# Altium schematic sheet HPC_GH.SchDoc: HPC connector ROW G and ROW H
size A4; Date: 20.05.2022; ApprovedBy: PFH; CompanyName: IAM Electronic GmbH; DrawnBy: PFH; Engineer: PFH; Revision: A; SheetNumber: 5; SheetTotal: 6; Projekt: FMC Power Module; Website: www.iamelectronic.com
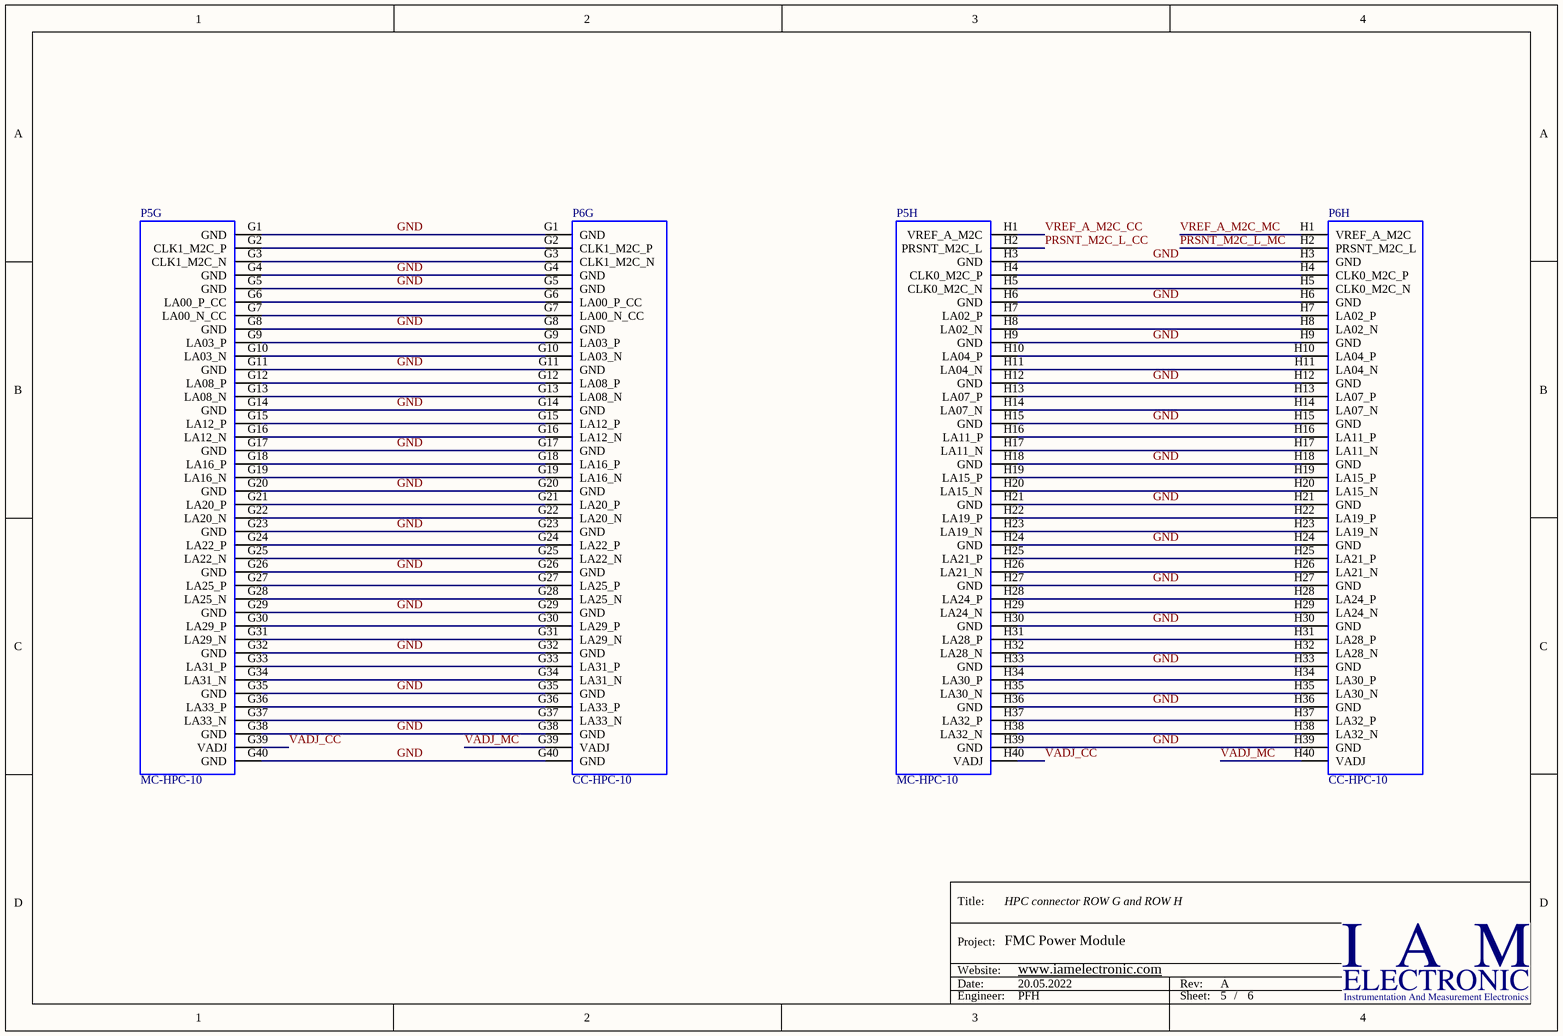
[diagram p0: HPC_GH.SchDoc]

## Parts
P5  MC-HPC-10  [ASP-134488-01]  (parts G,H of 10)
P6  CC-HPC-10  [ASP-134486-01]  (parts G,H of 10)

## Nets
GND: P5.G1(GND) P5.G4(GND) P5.G5(GND) P5.G8(GND) P5.G11(GND) P5.G14(GND) P5.G17(GND) P5.G20(GND) P5.G23(GND) P5.G26(GND) P5.G29(GND) P5.G32(GND) P5.G35(GND) P5.G38(GND) P5.G40(GND) P5.H3(GND) P5.H6(GND) P5.H9(GND) P5.H12(GND) P5.H15(GND) P5.H18(GND) P5.H21(GND) P5.H24(GND) P5.H27(GND) P5.H30(GND) P5.H33(GND) P5.H36(GND) P5.H39(GND) P6.G1(GND) P6.G4(GND) P6.G5(GND) P6.G8(GND) P6.G11(GND) P6.G14(GND) P6.G17(GND) P6.G20(GND) P6.G23(GND) P6.G26(GND) P6.G29(GND) P6.G32(GND) P6.G35(GND) P6.G38(GND) P6.G40(GND) P6.H3(GND) P6.H6(GND) P6.H9(GND) P6.H12(GND) P6.H15(GND) P6.H18(GND) P6.H21(GND) P6.H24(GND) P6.H27(GND) P6.H30(GND) P6.H33(GND) P6.H36(GND) P6.H39(GND)
PRSNT_M2C_L_CC: P5.H2(PRSNT_M2C_L)
PRSNT_M2C_L_MC: P6.H2(PRSNT_M2C_L)
VADJ_CC: P5.G39(VADJ) P5.H40(VADJ)
VADJ_MC: P6.G39(VADJ) P6.H40(VADJ)
VREF_A_M2C_CC: P5.H1(VREF_A_M2C)
VREF_A_M2C_MC: P6.H1(VREF_A_M2C)
NetP5_G2: P5.G2(CLK1_M2C_P) P6.G2(CLK1_M2C_P)
NetP5_G3: P5.G3(CLK1_M2C_N) P6.G3(CLK1_M2C_N)
NetP5_G6: P5.G6(LA00_P_CC) P6.G6(LA00_P_CC)
NetP5_G7: P5.G7(LA00_N_CC) P6.G7(LA00_N_CC)
NetP5_G9: P5.G9(LA03_P) P6.G9(LA03_P)
NetP5_G10: P5.G10(LA03_N) P6.G10(LA03_N)
NetP5_G12: P5.G12(LA08_P) P6.G12(LA08_P)
NetP5_G13: P5.G13(LA08_N) P6.G13(LA08_N)
NetP5_G15: P5.G15(LA12_P) P6.G15(LA12_P)
NetP5_G16: P5.G16(LA12_N) P6.G16(LA12_N)
NetP5_G18: P5.G18(LA16_P) P6.G18(LA16_P)
NetP5_G19: P5.G19(LA16_N) P6.G19(LA16_N)
NetP5_G21: P5.G21(LA20_P) P6.G21(LA20_P)
NetP5_G22: P5.G22(LA20_N) P6.G22(LA20_N)
NetP5_G24: P5.G24(LA22_P) P6.G24(LA22_P)
NetP5_G25: P5.G25(LA22_N) P6.G25(LA22_N)
NetP5_G27: P5.G27(LA25_P) P6.G27(LA25_P)
NetP5_G28: P5.G28(LA25_N) P6.G28(LA25_N)
NetP5_G30: P5.G30(LA29_P) P6.G30(LA29_P)
NetP5_G31: P5.G31(LA29_N) P6.G31(LA29_N)
NetP5_G33: P5.G33(LA31_P) P6.G33(LA31_P)
NetP5_G34: P5.G34(LA31_N) P6.G34(LA31_N)
NetP5_G36: P5.G36(LA33_P) P6.G36(LA33_P)
NetP5_G37: P5.G37(LA33_N) P6.G37(LA33_N)
NetP5_H4: P5.H4(CLK0_M2C_P) P6.H4(CLK0_M2C_P)
NetP5_H5: P5.H5(CLK0_M2C_N) P6.H5(CLK0_M2C_N)
NetP5_H7: P5.H7(LA02_P) P6.H7(LA02_P)
NetP5_H8: P5.H8(LA02_N) P6.H8(LA02_N)
NetP5_H10: P5.H10(LA04_P) P6.H10(LA04_P)
NetP5_H11: P5.H11(LA04_N) P6.H11(LA04_N)
NetP5_H13: P5.H13(LA07_P) P6.H13(LA07_P)
NetP5_H14: P5.H14(LA07_N) P6.H14(LA07_N)
NetP5_H16: P5.H16(LA11_P) P6.H16(LA11_P)
NetP5_H17: P5.H17(LA11_N) P6.H17(LA11_N)
NetP5_H19: P5.H19(LA15_P) P6.H19(LA15_P)
NetP5_H20: P5.H20(LA15_N) P6.H20(LA15_N)
NetP5_H22: P5.H22(LA19_P) P6.H22(LA19_P)
NetP5_H23: P5.H23(LA19_N) P6.H23(LA19_N)
NetP5_H25: P5.H25(LA21_P) P6.H25(LA21_P)
NetP5_H26: P5.H26(LA21_N) P6.H26(LA21_N)
NetP5_H28: P5.H28(LA24_P) P6.H28(LA24_P)
NetP5_H29: P5.H29(LA24_N) P6.H29(LA24_N)
NetP5_H31: P5.H31(LA28_P) P6.H31(LA28_P)
NetP5_H32: P5.H32(LA28_N) P6.H32(LA28_N)
NetP5_H34: P5.H34(LA30_P) P6.H34(LA30_P)
NetP5_H35: P5.H35(LA30_N) P6.H35(LA30_N)
NetP5_H37: P5.H37(LA32_P) P6.H37(LA32_P)
NetP5_H38: P5.H38(LA32_N) P6.H38(LA32_N)

## Notes on the sheet
- Title:
- Project:
- Date:
- Website:
- Rev:
- Engineer:
- Sheet:
- /

## Library data of the parts
P5 = MC-HPC-10: MC-HPC-10, FMC High-pin count connector, lead free, 400 I/Os, male, 10 mm mated stack height; Manufacturer: Samtec; Manufacturer Ref: SEAM-40-03.5-S-10-2-A-K-TR-VITA57.0; Pitch: 1.27 mm; Mated Stack Height: 10 mm; Solder Type: Lead-Free; Number I/O: 400; PartName: ASP-134488-01; Part: ASP-134488-01; Vita PartNumber: MC-HPC-10; Pin Count: High; Gender: male; Supplier 1: Digi-Key; Supplier Part Number 1: SAM8730-ND
P6 = CC-HPC-10: CC-HPC-10, FMC High-pin count connector, lead free, 400 I/Os, female, 10 mm mated stack height; Manufacturer: Samtec; Manufacturer Ref: SEAF-40-06.5-10-A; Pitch: 1.27 mm; Mated Stack Height: 10 mm; Solder Type: Lead-Free; Number I/O: 400; PartName: ASP-134486-01; Part: ASP-134486-01; Vita PartNumber: CC-HPC-10; Pin Count: High; Gender: female; Supplier 1: Digi-Key; Supplier Part Number 1: SAM8728-ND